# Altium schematic sheet ГРЛМ.468332.031Э3 (Лист 2).SchDoc
size 420 x 297 mm; CheckedBy: Солдатов А.Ю.; Author: Соколов А.Р.; Organization: Формат А3; Address1: Схема электрическая; Address2: принципиальная; Address3: 123456; Address4: ЯДИМ.ХХХХХХ.ХХХЭ3; DocumentNumber: ГРЛМ.468332.031Э3; Revision: 0; SheetNumber: 2; SheetTotal: 3; PageSetup: Record=PageOptions|CenterHorizontal=True|CenterVertical=True|PrintScale=0.66|XCorrection=0.00|YCorrection=0.00|PrintKind=1|BorderSize=5000000|LeftOffset=0|BottomOffset=0|Orientation=2|PaperLength=4200|PaperWidth=2970|Scale=100|PaperSource=7|PrintQuality=-3|MediaType=1|DitherType=10|PrintScaleMode=0|PaperKind=A3|PaperIndex=8; ListStatus: Нов.; FileName: ГРЛМ.468332.031Э3.pdf; ProjectName: Плата
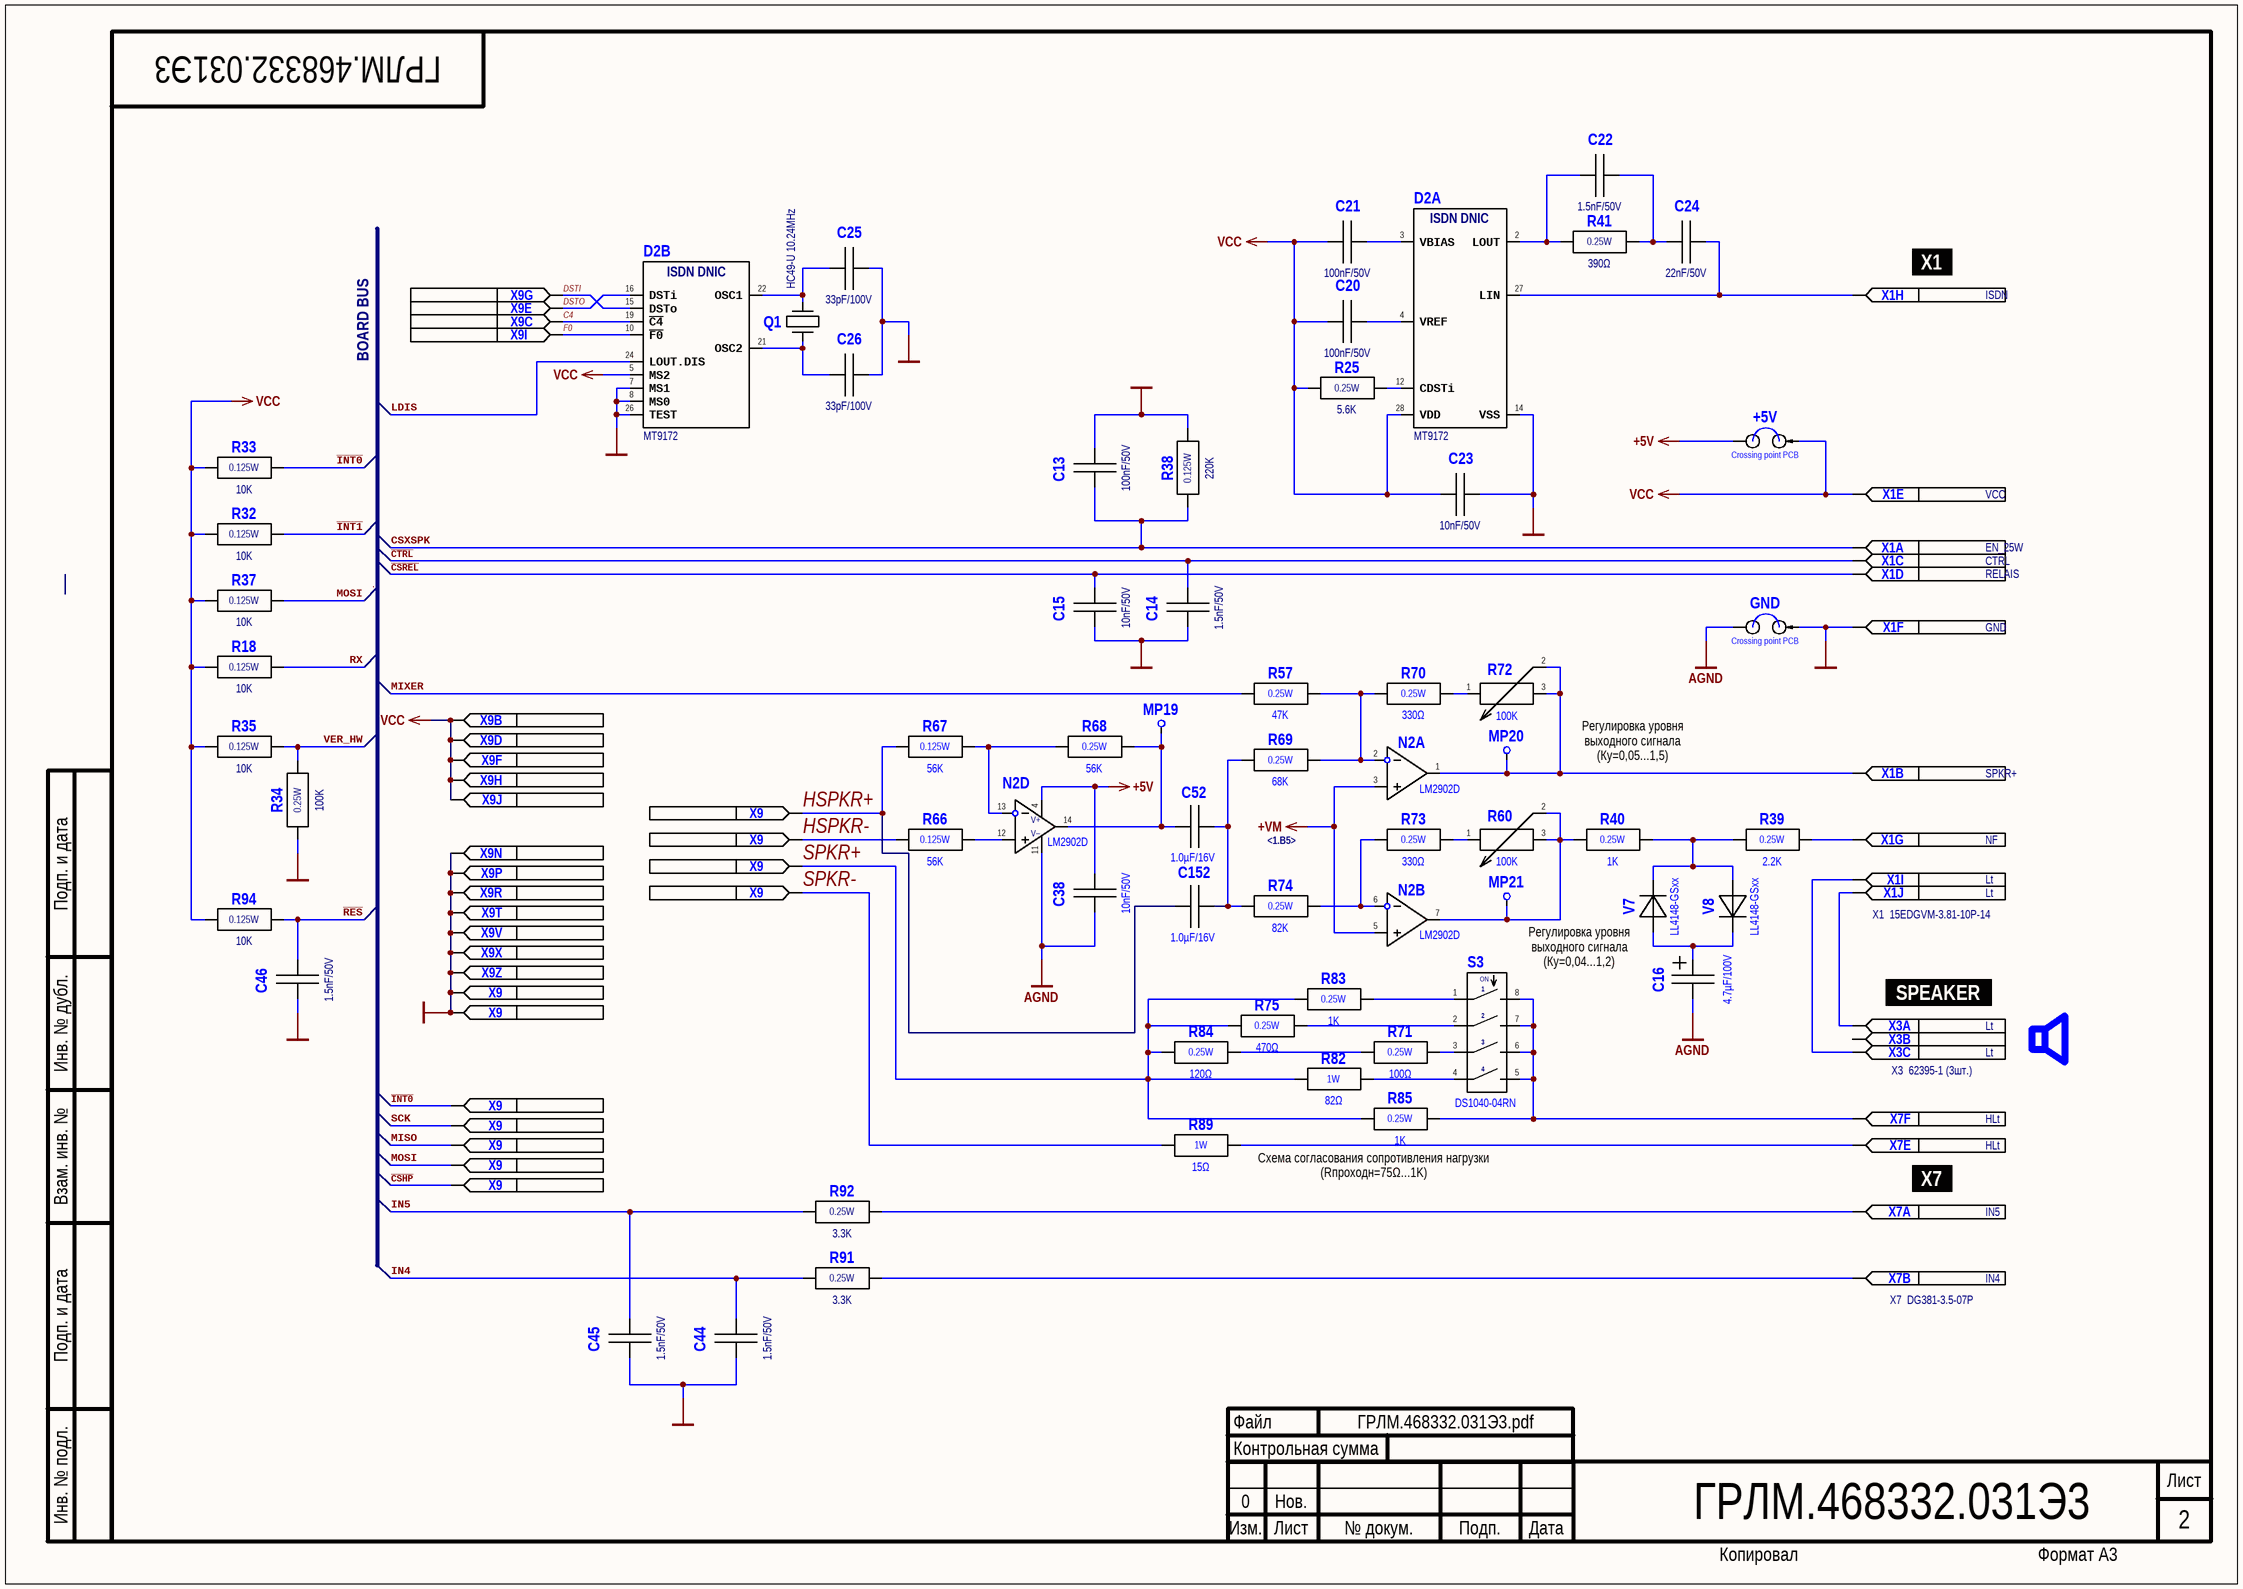
[diagram p0: ГРЛМ.468332.031Э3 (Лист 2).SchDoc]

## Parts
(Parts that share a designator on the sheet are numbered #1, #2 ... from top to bottom, then left to right.)
+5V  Crossing point PCB  [Crossing point PCB]
?#1  (no value)  (graphical)
?#2  (no value)  (graphical)
?#3  (no value)  (graphical)
C13  100nF/50V  [SMD Capacitor 0805]
C14  1.5nF/50V  [SMD Capacitor 0805]
C15  10nF/50V  [SMD Capacitor 0805]
C16  4.7µF/100V  [Capacitor  electrolytic 5x11mm]
C20  100nF/50V  [SMD Capacitor 0805]
C21  100nF/50V  [SMD Capacitor 0805]
C22  1.5nF/50V  [SMD Capacitor 0805]
C23  10nF/50V  [SMD Capacitor 0805]
C24  22nF/50V  [SMD Capacitor 0805]
C25  33pF/100V  [SMD Capacitor 0805]
C26  33pF/100V  [SMD Capacitor 0805]
C38  10nF/50V  [SMD Capacitor 0805]
C44  1.5nF/50V  [SMD Capacitor 0805]
C45  1.5nF/50V  [SMD Capacitor 0805]
C46  1.5nF/50V  [SMD Capacitor 0805]
C52  1.0µF/16V  [SMD Capacitor 0805]
C152  1.0µF/16V  [SMD Capacitor 0805]
D2  MT9172  [PLCC28 SMD]  (parts A,B of 2)
GND  Crossing point PCB  [Crossing point PCB]
MP19  TestPoint SMD  [Test point SMD]  (value not drawn)
MP20  TestPoint SMD  [Test point SMD]  (value not drawn)
MP21  TestPoint SMD  [Test point SMD]  (value not drawn)
N2  LM2902D  [SO14]  (parts A,B,D of 4)
Q1  HC49-U 10.24MHz  [HC-49U Quartz Crystal Resonator]
R18  10K  Power dissipation: 0.125W  [SMD Resistor 0805]
R25  5.6K  Power dissipation: 0.25W  [SMD Resistor 1206]
R32  10K  Power dissipation: 0.125W  [SMD Resistor 0805]
R33  10K  Power dissipation: 0.125W  [SMD Resistor 0805]
R34  100K  Power dissipation: 0.25W  [SMD Resistor 1206]
R35  10K  Power dissipation: 0.125W  [SMD Resistor 0805]
R37  10K  Power dissipation: 0.125W  [SMD Resistor 0805]
R38  220K  Power dissipation: 0.125W  [SMD Resistor 0805]
R39  2.2K  Power dissipation: 0.25W  [SMD Resistor 1206]
R40  1K  Power dissipation: 0.25W  [SMD Resistor 1206]
R41  390Ω  Power dissipation: 0.25W  [SMD Resistor 1206]
R57  47K  Power dissipation: 0.25W  [SMD Resistor 1206]
R60  100K  [3362H Square Trimming Potentiometer]
R66  56K  Power dissipation: 0.125W  [SMD Resistor 0805]
R67  56K  Power dissipation: 0.125W  [SMD Resistor 0805]
R68  56K  Power dissipation: 0.25W  [SMD Resistor 1206]
R69  68K  Power dissipation: 0.25W  [SMD Resistor 1206]
R70  330Ω  Power dissipation: 0.25W  [SMD Resistor 1206]
R71  100Ω  Power dissipation: 0.25W  [SMD Resistor 1206]
R72  100K  [3362H Square Trimming Potentiometer]
R73  330Ω  Power dissipation: 0.25W  [SMD Resistor 1206]
R74  82K  Power dissipation: 0.25W  [SMD Resistor 1206]
R75  470Ω  Power dissipation: 0.25W  [SMD Resistor 1206]
R82  82Ω  Power dissipation: 1W  [Resistor FMP100 1W Yageo]
R83  1K  Power dissipation: 0.25W  [SMD Resistor 1206]
R84  120Ω  Power dissipation: 0.25W  [SMD Resistor 1206]
R85  1K  Power dissipation: 0.25W  [SMD Resistor 1206]
R89  15Ω  Power dissipation: 1W  [Resistor FMP100 1W Yageo]
R91  3.3K  Power dissipation: 0.25W  [SMD Resistor 1206]
R92  3.3K  Power dissipation: 0.25W  [SMD Resistor 1206]
R94  10K  Power dissipation: 0.125W  [SMD Resistor 0805]
S3  DS1040-04RN  [DS1040-04 DIP Switch]
V7  LL4148-GSxx  [Diode SOD80C (Anode pin 1)]
V8  LL4148-GSxx  [Diode SOD80C (Anode pin 1)]
X1  Connector 10 pins (universal)  [Connector 15EDGVM-3.81-10P]  (value not drawn)  (parts A,B,C,D,E,F,G,H,I,J of 10)
X3  62395-1 (3ps)  [Faston Connector 3 x 2.8 mm]  (value not drawn)  (parts A,B,C of 3)
X7  DG381-3.5-07P  [DG381-3.5-07P Terminals]  (value not drawn)  (parts A,B,E,F of 7)
X9  5177983-2  [Connector 5177983-2]  (value not drawn)  (parts B,C,D,E,F,G,H,I,J,N,P,R,T,V,X,Z,28,30,31,33,35,37,56,57,58,59,60 of 60)

## Nets
+5V: +5V.2 C38.2 N2.4
+VM: N2.3 N2.5
AGND: C16.2 C38.1 GND.2 N2.11
DGND: C13.2 C14.1 C15.1 C23.1 C25.1 C26.1 C44.1 C45.1 C46.1 D2.7(MS1) D2.8(MS0) D2.14(VSS) D2.26(TEST) GND.1 R34.1 R38.2 X1.6 X9.14 X9.16 X9.18 X9.20 X9.22 X9.24 X9.26 X9.28 X9.30
VCC: +5V.1 C20.2 C21.2 C23.2 D2.5(MS2) D2.28(VDD) R18.1 R25.2 R32.1 R33.1 R35.1 R37.1 R94.1 X1.5 X9.2 X9.4 X9.6 X9.8 X9.10
C4: D2.19(~{C4}) X9.3
~{CSHP}: X9.56
~{CSREL}: C15.2 X1.4
~{CTRL}: C14.2 X1.3
CSXSPK: C13.1 R38.1 X1.1
DSTI: D2.15(DSTo) X9.7
DSTO: D2.16(DSTi) X9.5
F0: D2.10(~{F0}) X9.9
HSPKR+: C152.2 R67.1 X9.33
HSPKR-: R66.1 X9.31
~{INT0}: R33.2 X9.59
~{INT1}: R32.2
IN4: C44.2 R91.1
IN5: C45.2 R92.1
LDIS: D2.24(LOUT.DIS)
MISO: X9.60
MIXER: R57.1
MOSI: R37.2 X9.58
~{RES}: C46.2 R94.2
RX: R18.2
SCK: X9.57
SPKR+: R75.1 R82.1 R83.1 R84.1 R85.1 X9.37
SPKR-: R89.1 X9.35
VER_HW: R34.2 R35.2
NetC16_1: C16.1 V7.1 V8.2
NetC20_1: C20.1 D2.4(VREF)
NetC21_1: C21.1 D2.3(VBIAS)
NetC22_1: C22.1 C24.2 R41.1
NetC22_2: C22.2 D2.2(LOUT) R41.2
NetC24_1: C24.1 D2.27(LIN) X1.8
NetC25_2: C25.2 D2.22(OSC1) Q1.2
NetC26_2: C26.2 D2.21(OSC2) Q1.1
NetC52_1: C52.1 C152.1 R69.1 R74.1
NetC52_2: C52.2 MP19.1 N2.14 R68.2
NetD2_12: D2.12(CDSTi) R25.1
NetMP20_1: MP20.1 N2.1 R72.2 R72.3 X1.2
NetMP21_1: MP21.1 N2.7 R40.1 R60.2 R60.3
NetN2_2: N2.2 R57.2 R69.2 R70.1
NetN2_6: N2.6 R73.1 R74.2
NetN2_12: N2.12 R66.2
NetN2_13: N2.13 R67.2 R68.1
NetR39_1: R39.1 R40.2 V7.2 V8.1
NetR39_2: R39.2 X1.7
NetR60_1: R60.1 R73.2
NetR70_2: R70.2 R72.1
NetR71_1: R71.1 R84.2
NetR71_2: R71.2 S3.3
NetR75_2: R75.2 S3.2
NetR82_2: R82.2 S3.4
NetR83_2: R83.2 S3.1
NetR85_2: R85.2 S3.5 S3.6 S3.7 S3.8 X7.6
NetR89_2: R89.2 X7.5
NetR91_2: R91.2 X7.2
NetR92_2: R92.2 X7.1
NetX1_9: X1.9 X3.3
NetX1_10: X1.10 X3.1

Not connected (* = marked no-connect by the designer): X3 2

## Buses and harness runs
bus ..

## Notes on the sheet
- BOARD BUS
- (near X1) X1
- ISDN
- VCC
- EN_25W
- RELAIS
- CTRL
- GND
- Регулировка уровня выходного сигнала (Ку=0,05...1,5)
- SPKR+
- <1.B5>
- NF
- (near X1) X1  15EDGVM-3.81-10P-14
- Lt
- (near V7) Регулировка уровня выходного сигнала (Ку=0,04...1,2)
- (near X3) SPEAKER
- (near X3) X3  62395-1 (3шт.)
- HLt
- (near R89) Схема согласования сопротивления нагрузки (Rпроходн=75Ω...1K)
- (near X7) X7
- IN5
- IN4
- (near X7) X7  DG381-3.5-07P
- Подп. и дата
- Инв. № дубл.
- Взам. инв. №
- Инв. № подл.
- Файл
- Контрольная сумма
- Лист
- Изм.
- № докум.
- Подп.
- Дата
- Копировал
- Формат А3
- (in symbol DIP-SWITCH DS1040-04RN) ON
- (in symbol LM2902D(DT), part D) V+; V–
- (in symbol MT9172 (PLCC28), part A) ISDN DNIC
- (in symbol MT9172 (PLCC28), part B) ISDN DNIC

## Library data of the parts
+5V GND = Crossing point PCB: Crossing point
?#1 = Штамп с развернутым обозначением документа
?#2 = Левый нижний угловой штамп
?#3 = Основная напись второго и последующих листов
C13 C20 C21 = Capacitor: Partnumber: CC0805KRX7R9BB104; Vendor: Yageo; Type: Конденсатор керамический 100 нФ 5% 50В SMD 0805
C14 C22 C44-C46 = Capacitor: Partnumber: CC0805JRNPO9BN152; Vendor: Yageo; Type: Конденсатор керамический 1,5 нФ 5% 50В SMD 0805
C15 C23 C38 = Capacitor: Partnumber: CC0805KRX7R9BB103; Vendor: Yageo; Type: Конденсатор керамический 10 нФ 5% 50В SMD 0805
C16 = Capacitor Electrolytic: Partnumber: К50-35-100В-4,7мкФ 5х11мм; Type: Конденсатор электролитический 4,7 мкФ ±20% 100В
C24 = Capacitor: Partnumber: CC0805KRX7R9BB223; Vendor: Yageo; Type: Конденсатор керамический 22 нФ 5% 50В SMD 0805
C25 C26 = Capacitor: Partnumber: CC0805JRNPO0BN330; Vendor: Yageo; Type: Конденсатор керамический 33 пФ 5% 100В COG SMD
C52 C152 = Capacitor: Partnumber: GRM21BR71C105K; Vendor: Yageo; Type: Конденсатор керамический smd 1 мкФ X7R 10% 16В 0805
D2 = MT9172 (PLCC28): Digital Subscriber Interface Circuit. Digital Network ISDN Interface Circuit. Full duplex digital  transmitter up to 160 kbit/s.; Vendor: MITEL; Type: Микросхема цифрового интерфейса ISDN; ComponentLink1URL: null; Package: PLCC28; Partnumber: MT9172; ComponentLink1Description: ComponentLink1URL
MP19-MP21 = TestPoint SMD: SMD Test Point
N2 = LM2902D(DT): Low-power quad operational amplifiers / SO-14; Vendor: NXP; ComponentLink1URL: *; ComponentLink1URL: \STM32F429.pdf; Type: Операционный усилитель LM2902; Package: SOIC14; Partnumber: LM2902D(DT)
Q1 = Quartz resonator: Quartz-crystal resonator; Partnumber: HC49-U 10.24MHz
R18 R32 R33 R35 R37 R94 = Resistor: Partnumber: RC0805JR-0710KL; Vendor: Yageo; Type: Резистор 10 кОм 5% 0,125Вт SMD 0805
R25 = Resistor: Partnumber: RC1206JR-075K6L; Vendor: Yageo; Type: Резистор 5,6 кОм 5% 0,25Вт SMD 1206
R34 = Resistor: Partnumber: RC1206JR-07100KL; Vendor: Yageo; Type: Резистор 100 кОм 5% 0,25Вт SMD 1206
R38 = Resistor: Partnumber: RC0805JR-07220KL; Vendor: Yageo; Type: Резистор 220 кОм 5% 0,125Вт SMD 0805
R39 = Resistor: Partnumber: RC1206JR-072K2L; Vendor: Yageo; Type: Резистор 2.2 кОм 5% 0,25Вт SMD 1206
R40 R83 R85 = Resistor: Partnumber: RC1206JR-071KL; Vendor: Yageo; Type: Резистор 1,0 кОм 5% 0,25Вт SMD 1206
R41 = Resistor: Partnumber: RC1206JR-07390RL; Vendor: Yageo; Type: Резистор 390 Ом 5% 0,25Вт SMD 1206
R57 = Resistor: Partnumber: RC1206JR-0747KL; Vendor: Yageo; Type: Резистор 47 кОм 5% 0,25Вт SMD 1206
R60 R72 = Resistor adjustable: Partnumber: 3362H-1-104LF; Vendor: Bourns; Type: Резистор подстроечный
R66 R67 = Resistor: Partnumber: RC0805JR-0756KL; Vendor: Yageo; Type: Резистор 56 кОм 5% 0,125Вт SMD 0805
R68 = Resistor: Partnumber: RC1206JR-0756KL; Vendor: Yageo; Type: Резистор 56 кОм 5% 0,25Вт SMD 1206
R69 = Resistor: Partnumber: RC1206JR-0768KL; Vendor: Yageo; Type: Резистор 68 кОм 5% 0,25Вт SMD 1206
R70 R73 = Resistor: Partnumber: RC1206JR-07330RL; Vendor: Yageo; Type: Резистор 330 Ом 5% 0,25Вт SMD 1206
R71 = Resistor: Partnumber: RC1206JR-07100RL; Vendor: Yageo; Type: Резистор 100 Ом 5% 0,25Вт SMD 1206
R74 = Resistor: Partnumber: RC1206JR-0782KL; Vendor: Yageo; Type: Резистор 82 кОм 5% 0,25Вт SMD 1206
R75 = Resistor: Partnumber: RC1206JR-07470RL; Vendor: Yageo; Type: Резистор 470 Ом 5% 0,25Вт SMD 1206
R82 = Resistor: Partnumber: FMP100JT-52-82R; Vendor: Yageo; Type: Резистор металлоплёночный 82 Ом 5% 1Вт
R84 = Resistor: Partnumber: RC1206JR-07120RL; Vendor: Yageo; Type: Резистор 120 Ом 5% 0,25Вт SMD 1206
R89 = Resistor: Partnumber: FMP100JT-52-15R; Vendor: Yageo; Type: Резистор металлоплёночный 15 Ом 5% 1Вт
R91 R92 = Resistor: Partnumber: RC1206JR-073K3L; Vendor: Yageo; Type: Резистор 3,3 кОм 5% 0,25Вт SMD 1206
S3 = DIP-SWITCH DS1040-04RN: DIP-switch, 4 NO Groups, by Connfly; Vendor: Connfly; Partnumber: DS1040-04RN; Type: DIP-переключатель 4-канальный, НР
V7 V8 = Diode: Vendor: Vishay; Partnumber: LL4148-GSxx; Type: Диод ультрабыстрый SMD MELF
X1 = Connector 10 pins (universal): Partnumber: 15EDGVM-3.81-10P-14; Vendor: Degson; Type: Соединитель 10 контактов. Шаг 3,81 мм.
X3 = Connector 3 pins (universal): Vendor: TE Connectivity; Type: FASTON-110, 3-поз., ширина лезвия: 2,8mm; Partnumber: 62395-1 (3 ps)
X7 = Connector 7 pins (universal): Vendor: Degson; Type: Соединитель клеммный винтовой 7 полюсов; Partnumber: DG381-3.5-07P
X9 = Connector 60 pins (universal): Vendor: TE; Type: Соединитель 60 полюсов; Partnumber: 5177983-2